# Altium schematic sheet USB.SchDoc
size A4; SheetNumber: 2; SheetTotal: 6
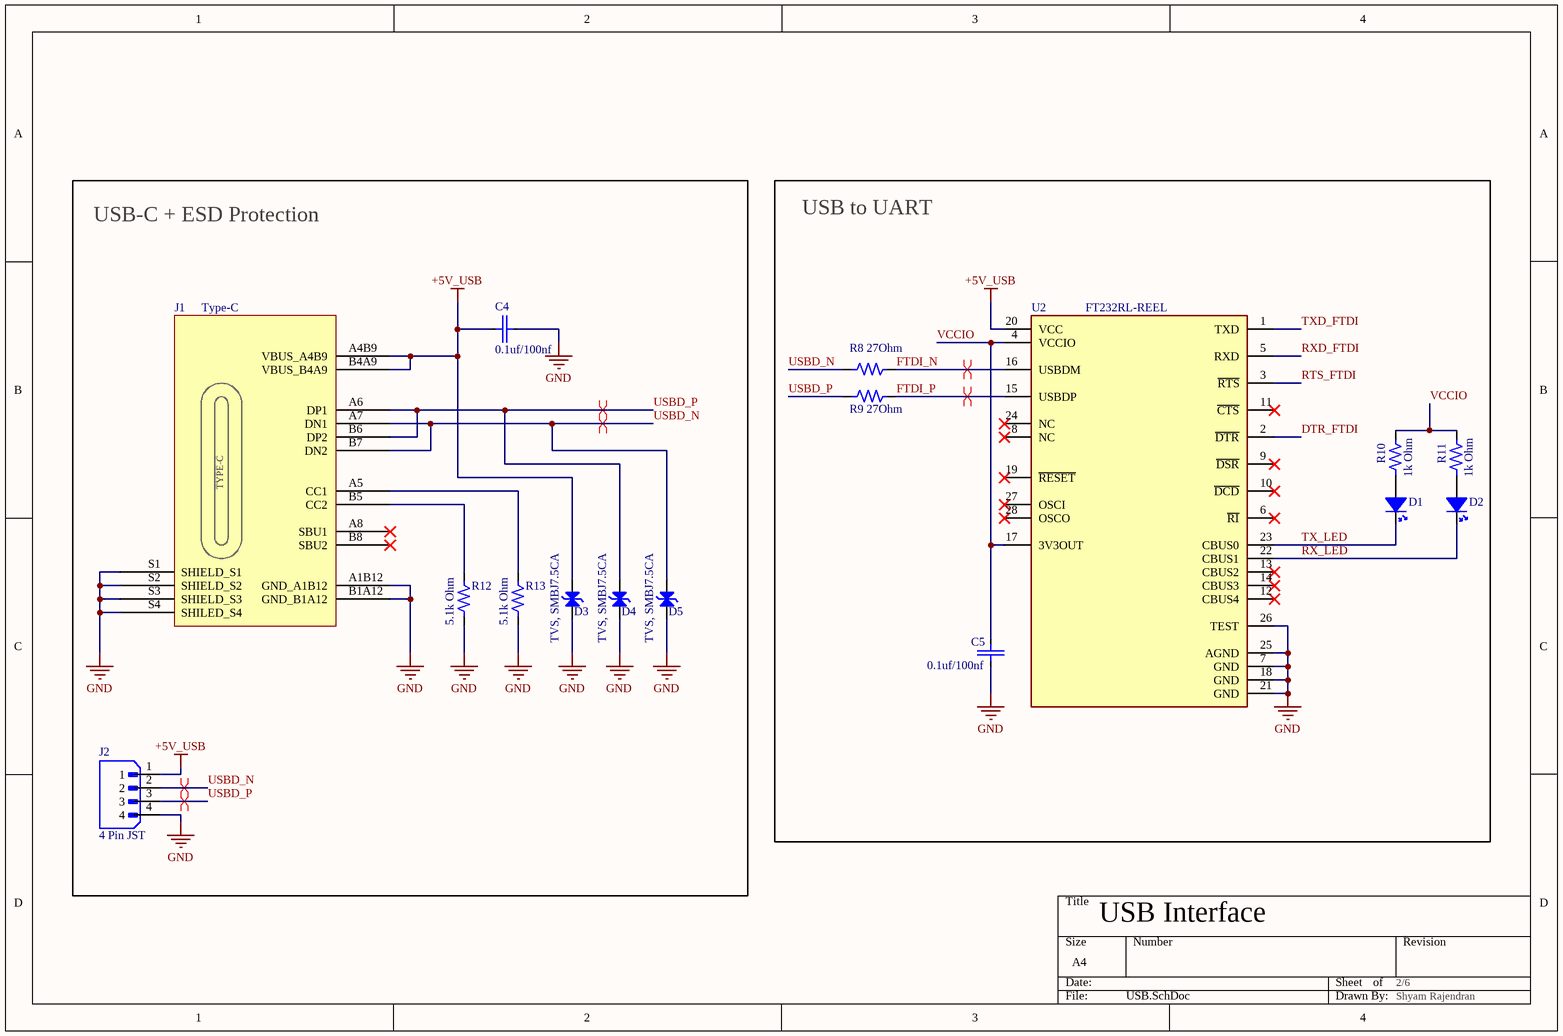
[diagram p0: USB.SchDoc]

## Parts
C4  0.1uf/100nf  [0.1uF Capacitor]
C5  0.1uf/100nf  [0.1uF Capacitor]
D1  Blue, 0805  [led blue]  (value not drawn)
D2  Blue, 0805  [led blue]  (value not drawn)
D3  TVS, SMBJ7.5CA  [TVS Diode]
D4  TVS, SMBJ7.5CA  [TVS Diode]
D5  TVS, SMBJ7.5CA  [TVS Diode]
J1  Type-C  [Type C]
J2  4 Pin JST  [JST_B4B-XH-A]
R8  27Ohm  [1k 0805 Resistor]
R9  27Ohm  [1k 0805 Resistor]
R10  1k Ohm  [1k 0805 Resistor]
R11  1k Ohm  [1k 0805 Resistor]
R12  5.1k Ohm  [RESC2012X60N]
R13  5.1k Ohm  [RESC2012X60N]
U2  FT232RL-REEL  [FP-SSOP-28-IPC_B]

## Blocks framed on the sheet
USB-C + ESD Protection: C4 D3-D5 J1 J2 R12 R13
USB to UART: C5 D1 D2 R8-R11 U2

## Nets
+5V_USB: C4.2 D3.2 J1.A4B9(VBUS_A4B9) J1.B4A9(VBUS_B4A9) J2.1 U2.20(VCC)
GND: C4.1 C5.1 D3.1 D4.1 D5.1 J1.A1B12(GND_A1B12) J1.B1A12(GND_B1A12) J1.S1(SHIELD_S1) J1.S2(SHIELD_S2) J1.S3(SHIELD_S3) J1.S4(SHILED_S4) J2.4 R12.1 R13.1 U2.7(GND) U2.18(GND) U2.21(GND) U2.25(AGND) U2.26(TEST)
DTR_FTDI: U2.2(~{DTR})
FTDI_N: R8.2 U2.16(USBDM)
FTDI_P: R9.2 U2.15(USBDP)
RTS_FTDI: U2.3(~{RTS})
RX_LED: D2.C U2.22(CBUS1)
RXD_FTDI: U2.5(RXD)
TX_LED: D1.C U2.23(CBUS0)
TXD_FTDI: U2.1(TXD)
USBD_N: D5.2 J1.A7(DN1) J1.B7(DN2) J2.2 R8.1
USBD_P: D4.2 J1.A6(DP1) J1.B6(DP2) J2.3 R9.1
VCCIO: C5.2 R10.2 R11.2 U2.4(VCCIO) U2.17(3V3OUT)
NetD1_A: D1.A R10.1
NetD2_A: D2.A R11.1
NetJ1_A5: J1.A5(CC1) R13.2
NetJ1_B5: J1.B5(CC2) R12.2

Not connected (* = marked no-connect by the designer): J1 A8(SBU1)* B8(SBU2)*; U2 6(~{RI})* 8(NC)* 9(~{DSR})* 10(~{DCD})* 11(~{CTS})* 12(CBUS4)* 13(CBUS2)* 14(CBUS3)* 19(~{RESET})* 24(NC)* 27(OSCI)* 28(OSCO)*

## Layout directives
differential pair; differential pair class DIFF90: FTDI_N, FTDI_P, USBD_N, USBD_P
differential pair: USBD_N, USBD_P

## Notes on the sheet
- USB Interface <BMP280>
- 2/6 <BMP280>
- Shyam Rajendran <BMP280>
- (in symbol Type-C) TYPE-C

## Library data of the parts
C4 C5 = CC0805KRX7R9BB104: 0.1 uF, Multilayer Ceramic Capacitor, 50 V, ï¿½ 10%, X7R, 0805 [2012 Metric]; Manufacturer: Yageo; Value: 100nF; Voltage Rating: 50V; Insulation Resistance: 100GR; Supplier: Future Electronics; Supplier Part Number: 2986263; Manufacturer Part Number: CC0805KRX7R9BB104; RoHS: Yes; Category: Ceramic Capacitors; Stock: 2884000; Pricing: 4000=0.009, 12000=0.0088, 40000=0.0085, 80000=0.0083, 160000=0.008 (USD); Mounting Technology: Surface Mount; Case/Package: 0805; Pins: 2; Case Code (Metric): 2012; Case Code (Imperial): 0805; Material: Ceramic; Min Operating Temperature: -55°C; Max Operating Temperature: 125°C; Packaging: Tape and Reel; Tolerance: 10%; Dielectric: X7R; Series: CC; Package Quantity: 4000; Voltage: 50V; Termination: SMD/SMT; Length: 2mm; Height: 0.85mm; Depth: 1.25mm; Radiation Hardening: No; RoHS Compliant: Yes; Lead Free: 5697LeadFree; Reach SVHC Compliant: No; Halogen Free: 5694HalogenFree
D1 D2 = LED Blue
D3-D5 = SMBJ7.5CA: SMBJ Series 5 W 9.21 V Bi-Directional Surface Mount TVS Diode - SMB; Manufacturer: Littelfuse; Max Reverse Leakage Current: 100uA; Reverse Voltage: 7.5V; Supplier: Digikey; Supplier Part Number: SMBJ7.5CALFCT-ND; Manufacturer Part Number: SMBJ7.5CA; RoHS: Yes; Category: TVS Diodes; Stock: 3822; Pricing: 1=0.33, 10=0.215, 100=0.115, 500=0.113, 1000=0.111 (USD); ComponentLink1URL: https://datasheet.ciiva.com/15143/getdatasheetpartid-149559-15143802.pdf?src-supplier=Verical; ComponentLink1Description: https://datasheet.ciiva.com/15143/getdatasheetpartid-149559-15143802.pdf?src-supplier=Verical; ComponentLink2URL: https://datasheet.ciiva.com/16487/littelfuse-tvs-diode-smbj-16487753.pdf?src-supplier=Future+Electronics; ComponentLink2Description: https://datasheet.ciiva.com/16487/littelfuse-tvs-diode-smbj-16487753.pdf?src-supplier=Future+Electronics; ComponentLink3URL: https://datasheet.ciiva.com/331/littelfuse-tvs-diode-smbj-datasheet-pdf-331604.pdf?src-supplier=Digikey; ComponentLink3Description: https://datasheet.ciiva.com/331/littelfuse-tvs-diode-smbj-datasheet-pdf-331604.pdf?src-supplier=Digikey; ComponentLink4URL: https://datasheet.ciiva.com/331/littelfuse-tvs-diode-smbj-datasheet-pdf-331605.pdf?src-supplier=Digikey; ComponentLink4Description: https://datasheet.ciiva.com/331/littelfuse-tvs-diode-smbj-datasheet-pdf-331605.pdf?src-supplier=Digikey; ComponentLink5URL: https://datasheet.ciiva.com/331/littelfuse-tvs-diode-smbj-datasheet-pdf-331606.pdf?src-supplier=Digikey; ComponentLink5Description: https://datasheet.ciiva.com/331/littelfuse-tvs-diode-smbj-datasheet-pdf-331606.pdf?src-supplier=Digikey; ComponentLink6URL: https://datasheet.ciiva.com/331/littelfuse-tvs-diode-smbj-datasheet-pdf-331616.pdf?src-supplier=Digikey; ComponentLink6Description: https://datasheet.ciiva.com/331/littelfuse-tvs-diode-smbj-datasheet-pdf-331616.pdf?src-supplier=Digikey; ComponentLink7URL: https://datasheet.ciiva.com/331/littelfuse-tvs-diode-smbj-datasheet-pdf-331617.pdf?src-supplier=Digikey; ComponentLink7Description: https://datasheet.ciiva.com/331/littelfuse-tvs-diode-smbj-datasheet-pdf-331617.pdf?src-supplier=Digikey; ComponentLink8URL: https://datasheet.ciiva.com/8062/13057-8062350.pdf?src-supplier=Element14; ComponentLink8Description: https://datasheet.ciiva.com/8062/13057-8062350.pdf?src-supplier=Element14
J1 = Type-C: USB Connector, 16 Contact(s), Female, Right Angle, Surface Mount Terminal, Locking, Receptacle; Manufacturer: Molex; Manufacturer Part Number: 217179-0001; USB Standard: USB 2.0; Current Rating: 1.25A; Number of Contacts: 16; Voltage Rating: 30V; Supplier: Avnet; Supplier Part Number: 35AJ1973; RoHS: No; Category: Connectors; Stock: 7075; Pricing: 1=1.05, 25=0.707, 100=0.609, 250=0.592, 500=0.575 (USD); Contact Material: Nickel,Gold; Min Operating Temperature: -40°C; Max Operating Temperature: 85°C; Gender: Receptacle; Height: 3.36mm
J2 = B4B-XH-A-JST: Board Connector, 4 Contact(s), 1 Row(s), Male, Straight, Solder Terminal,; Supplier: Digikey; Supplier Part Number: 455-B4B-XH-A-ND; Manufacturer: JST; Manufacturer Part Number: B4B-XH-A; RoHS: Yes; Category: FFC / FPC; Stock: 199106; Pricing: 1=0.17, 10=0.149, 100=0.1262, 500=0.1126, 1000=0.10721, 5000=0.09569, 10000=0.09112 (USD); Orientation: 5491OrientationType; ComponentLink1URL: https://datasheet.ciiva.com/14155/xh-series-eng-tds-14155433.pdf?src-supplier=Distrelec; ComponentLink1Description: https://datasheet.ciiva.com/14155/xh-series-eng-tds-14155433.pdf?src-supplier=Distrelec
R8 R9 = RT0805FRE0727RL: 27 Ohm, Res Thin Film 0805 1% 1/8W ±50ppm/°C Molded SMD SMD Paper T/R; Manufacturer: Yageo; Value: 27R; Power Rating: 125mW; Voltage Rating (DC): 150V; Supplier: Future Electronics; Supplier Part Number: 9105398; Manufacturer Part Number: RT0805FRE0727RL; RoHS: Yes; Category: Chip SMD Resistors; Stock: 30000; Pricing: 5000=0.0055, 20000=0.0053, 50000=0.0051, 125000=0.005, 200000=0.0048 (USD); Case/Package: 0805; Pins: 2; Case Code (Metric): 2012; Case Code (Imperial): 0805; Contact Plating: Tin,Matte; Min Operating Temperature: -55°C; Max Operating Temperature: 125°C; Tolerance: 1%; Packaging: Tape and Reel; Package Quantity: 5000; Number of Terminations: 2; Temperature Coefficient: 50ppm/°C; Max Power Dissipation: 125mW; Series: RT; Voltage Rating: 150V; Resistor Type: Thin Film; Termination: SMD/SMT; Resistance Tolerance: 1%; Length: 0.079inch; Width: 0.049inch; Height: 0.024inch; RoHS Compliant: Yes; Reach SVHC Compliant: Unknown; ComponentLink1URL: https://datasheet.ciiva.com/2561/pyu-rt-1-to-0-05-rohs-l-5-2561109.pdf?src-supplier=Digikey; ComponentLink1Description: https://datasheet.ciiva.com/2561/pyu-rt-1-to-0-05-rohs-l-5-2561109.pdf?src-supplier=Digikey; ComponentLink2URL: https://datasheet.ciiva.com/8889/pyu-rt-1-to-0-05-rohs-l-4-8889865.pdf?src-supplier=Avnet; ComponentLink2Description: https://datasheet.ciiva.com/8889/pyu-rt-1-to-0-05-rohs-l-4-8889865.pdf?src-supplier=Avnet; ComponentLink3URL: https://datasheet.ciiva.com/7942/1392914-7942123.pdf?src-supplier=Element14; ComponentLink3Description: https://datasheet.ciiva.com/7942/1392914-7942123.pdf?src-supplier=Element14; ComponentLink4URL: https://datasheet.ciiva.com/7942/1392914-7942124.pdf?src-supplier=Element14; ComponentLink4Description: https://datasheet.ciiva.com/7942/1392914-7942124.pdf?src-supplier=Element14
R10 R11 = RC0805FR-071KL: 1k Ohm, 0805, SMD Chip Resistor , ï¿½ 1%, 125 mW,[2012 Metric], Thick Film, General Purpose; Manufacturer: Yageo; Value: 1kR; Power Rating: 125mW; Voltage Rating: 150V; Temperature Coefficient: 100ppm/°C; Supplier: Future Electronics; Supplier Part Number: 8126013; Manufacturer Part Number: RC0805FR-071KL; RoHS: Yes; Category: Chip SMD Resistors; Stock: 5450000; Pricing: 5000=0.0021, 20000=0.002, 100000=0.0019, 200000=0.0018, 625000=0.0017 (USD); Case/Package: 0805; Pins: 2; Case Code (Metric): 2012; Case Code (Imperial): 0805; Min Operating Temperature: -55°C; Max Operating Temperature: 155°C; Tolerance: 1%; Packaging: Tape and Reel; Voltage Rating (DC): 150V; Resistor Type: Thick Film; Series: RC; Number of Terminations: 2; Termination: SMD/SMT; Max Power Dissipation: 125mW; Resistance Tolerance: 1%; Package Quantity: 1; Features: Moisture Resistant; Construction: Rectangular; Voltage Rating (AC): 150V; Length: 0.079inch; Width: 0.049inch; Height: 0.024inch; Depth: 1.25mm; RoHS Compliant: Yes; Reach SVHC Compliant: No; Military Standard: Not; Lead Free: Lead Free
R12 R13 = RC0805FR-075K1L: 5.1k Ohm, 0805, 0.125W, 150V, 1% +/-Tol, 100ppm/Cel, Surface Mount; Manufacturer: Yageo; Additional Feature: LASER TRIMMABLE; Power: 125mW; Rated Temperature: 70°C; Value: 5.1kR; Temperature Coefficient (ppm/Cel): 100; Package Height: 0.5mm; Package Length: 2mm; Package Width: 1.25mm; Supplier: Future Electronics; Supplier Part Number: 5647425; Manufacturer Part Number: RC0805FR-075K1L; RoHS: Yes; Category: Chip SMD Resistors; Stock: 15000; Pricing: 5000=0.0021, 20000=0.002, 100000=0.0019, 200000=0.0018, 625000=0.0017 (USD); Mounting Technology: Surface Mount; Pins: 2; Package Shape: Rectangular; Case/Package: 0805; Terminal Finish: Nickel; Min Operating Temperature: -55°C; Max Operating Temperature: 155°C; Tolerance: 1%; JESD-609 Code: e3; Termination: Wraparound; Resistor Type: FIXED RESISTOR; Construction: Chip; Packaging: Tape and Reel; Technology: METAL GLAZE/THICK FILM; Working Voltage: 150V; Reach SVHC Compliant: Yes; RoHS Compliant: Yes; ComponentLink1URL: https://datasheet.ciiva.com:443/pdfs/VipMasterIC/IC/YAGO/YAGO-S-A0008145938/YAGO-S-A0008145938-1.pdf?src-supplier=IHS+Markit; ComponentLink1Description: https://datasheet.ciiva.com:443/pdfs/VipMasterIC/IC/YAGO/YAGO-S-A0008145938/YAGO-S-A0008145938-1.pdf?src-supplier=IHS+Markit; ComponentLink2URL: https://datasheet.ciiva.com/11808/0900766b8106beab-11808171.pdf?src-supplier=Rs; ComponentLink2Description: https://datasheet.ciiva.com/11808/0900766b8106beab-11808171.pdf?src-supplier=Rs; ComponentLink3URL: https://datasheet.ciiva.com/2456/pyu-r-int-thick-7-2456979.pdf?src-supplier=Digikey; ComponentLink3Description: https://datasheet.ciiva.com/2456/pyu-r-int-thick-7-2456979.pdf?src-supplier=Digikey; ComponentLink4URL: https://datasheet.ciiva.com/2456/pyu-r-int-thick-7-2456980.pdf?src-supplier=Digikey; ComponentLink4Description: https://datasheet.ciiva.com/2456/pyu-r-int-thick-7-2456980.pdf?src-supplier=Digikey; ComponentLink5URL: https://datasheet.ciiva.com/15189/getdatasheetpartid-326574-15189996.pdf?src-supplier=Verical; ComponentLink5Description: https://datasheet.ciiva.com/15189/getdatasheetpartid-326574-15189996.pdf?src-supplier=Verical; ComponentLink6URL: https://datasheet.ciiva.com/2456/pyu-r-int-thick-7-2456978.pdf?src-supplier=Digikey; ComponentLink6Description: https://datasheet.ciiva.com/2456/pyu-r-int-thick-7-2456978.pdf?src-supplier=Digikey
U2 = FT232RL-REEL: USB Bus Controller, CMOS, PDSO28; Manufacturer: FTDI; Package Body Material: Plastic; Clock Frequency: 48MHz; Max Supply Current: 100uA; Max Supply Voltage: 5.25V; Min Supply Voltage: 3.3V; Qualification Status: Not Qualified; Supplier: Digikey; Supplier Part Number: 768-1007-1-ND; Manufacturer Part Number: FT232RL-REEL; RoHS: Yes; Category: Interface ICs; Stock: 4321; Pricing: 1=4.8, 10=4.35, 50=4.15, 100=3.95, 250=3.55, 500=3.15002, 1000=2.95001, 2000=2.95002 (USD); Case/Package: SSOP; Pins: 28; Package Shape: Rectangular; Min Operating Temperature: -40°C; Max Operating Temperature: 85°C; JESD-30 Code: R-PDSO-G28; Moisture Sensitivity Level: 3; Package Style: SMALL OUTLINE, SHRINK PITCHMeter; Surface Mount: Yes; Technology: CMOS; Terminal Form: Gull Wing; Terminal Position: DUAL; Length: 10.2mm; Width: 5.3mm; Height - Seated (Max): 2mm; Terminal Pitch: 0.65mm; Temperature Grade: INDUSTRIAL; Reach SVHC Compliant: Yes; RoHS Compliant: Yes; ComponentLink1URL: https://datasheet.ciiva.com:443/pdfs/VipMasterIC/IC/FTDI/FTDI-S-A0007980421/FTDI-S-A0007980421-1.pdf?src-supplier=IHS+Markit; ComponentLink1Description: https://datasheet.ciiva.com:443/pdfs/VipMasterIC/IC/FTDI/FTDI-S-A0007980421/FTDI-S-A0007980421-1.pdf?src-supplier=IHS+Markit; ComponentLink2URL: https://datasheet.ciiva.com/4787/ds-ft232r-11534-4787658.pdf?src-supplier=Mouser; ComponentLink2Description: https://datasheet.ciiva.com/4787/ds-ft232r-11534-4787658.pdf?src-supplier=Mouser; ComponentLink3URL: https://datasheet.ciiva.com/15150/getdatasheetpartid-643207-15150506.pdf?src-supplier=Verical; ComponentLink3Description: https://datasheet.ciiva.com/15150/getdatasheetpartid-643207-15150506.pdf?src-supplier=Verical; ComponentLink4URL: https://datasheet.ciiva.com/1787/ds-ft232r-1787048.pdf?src-supplier=Digikey; ComponentLink4Description: https://datasheet.ciiva.com/1787/ds-ft232r-1787048.pdf?src-supplier=Digikey; ComponentLink5URL: https://datasheet.ciiva.com/1787/ds-ft232r-1787047.pdf?src-supplier=Digikey; ComponentLink5Description: https://datasheet.ciiva.com/1787/ds-ft232r-1787047.pdf?src-supplier=Digikey; ComponentLink6URL: https://datasheet.ciiva.com/1787/ds-ft232r-1787049.pdf?src-supplier=Digikey; ComponentLink6Description: https://datasheet.ciiva.com/1787/ds-ft232r-1787049.pdf?src-supplier=Digikey; ComponentLink7URL: https://datasheet.ciiva.com/16200/ds-ft232r-16200652.pdf?src-supplier=Future+Electronics; ComponentLink7Description: https://datasheet.ciiva.com/16200/ds-ft232r-16200652.pdf?src-supplier=Future+Electronics